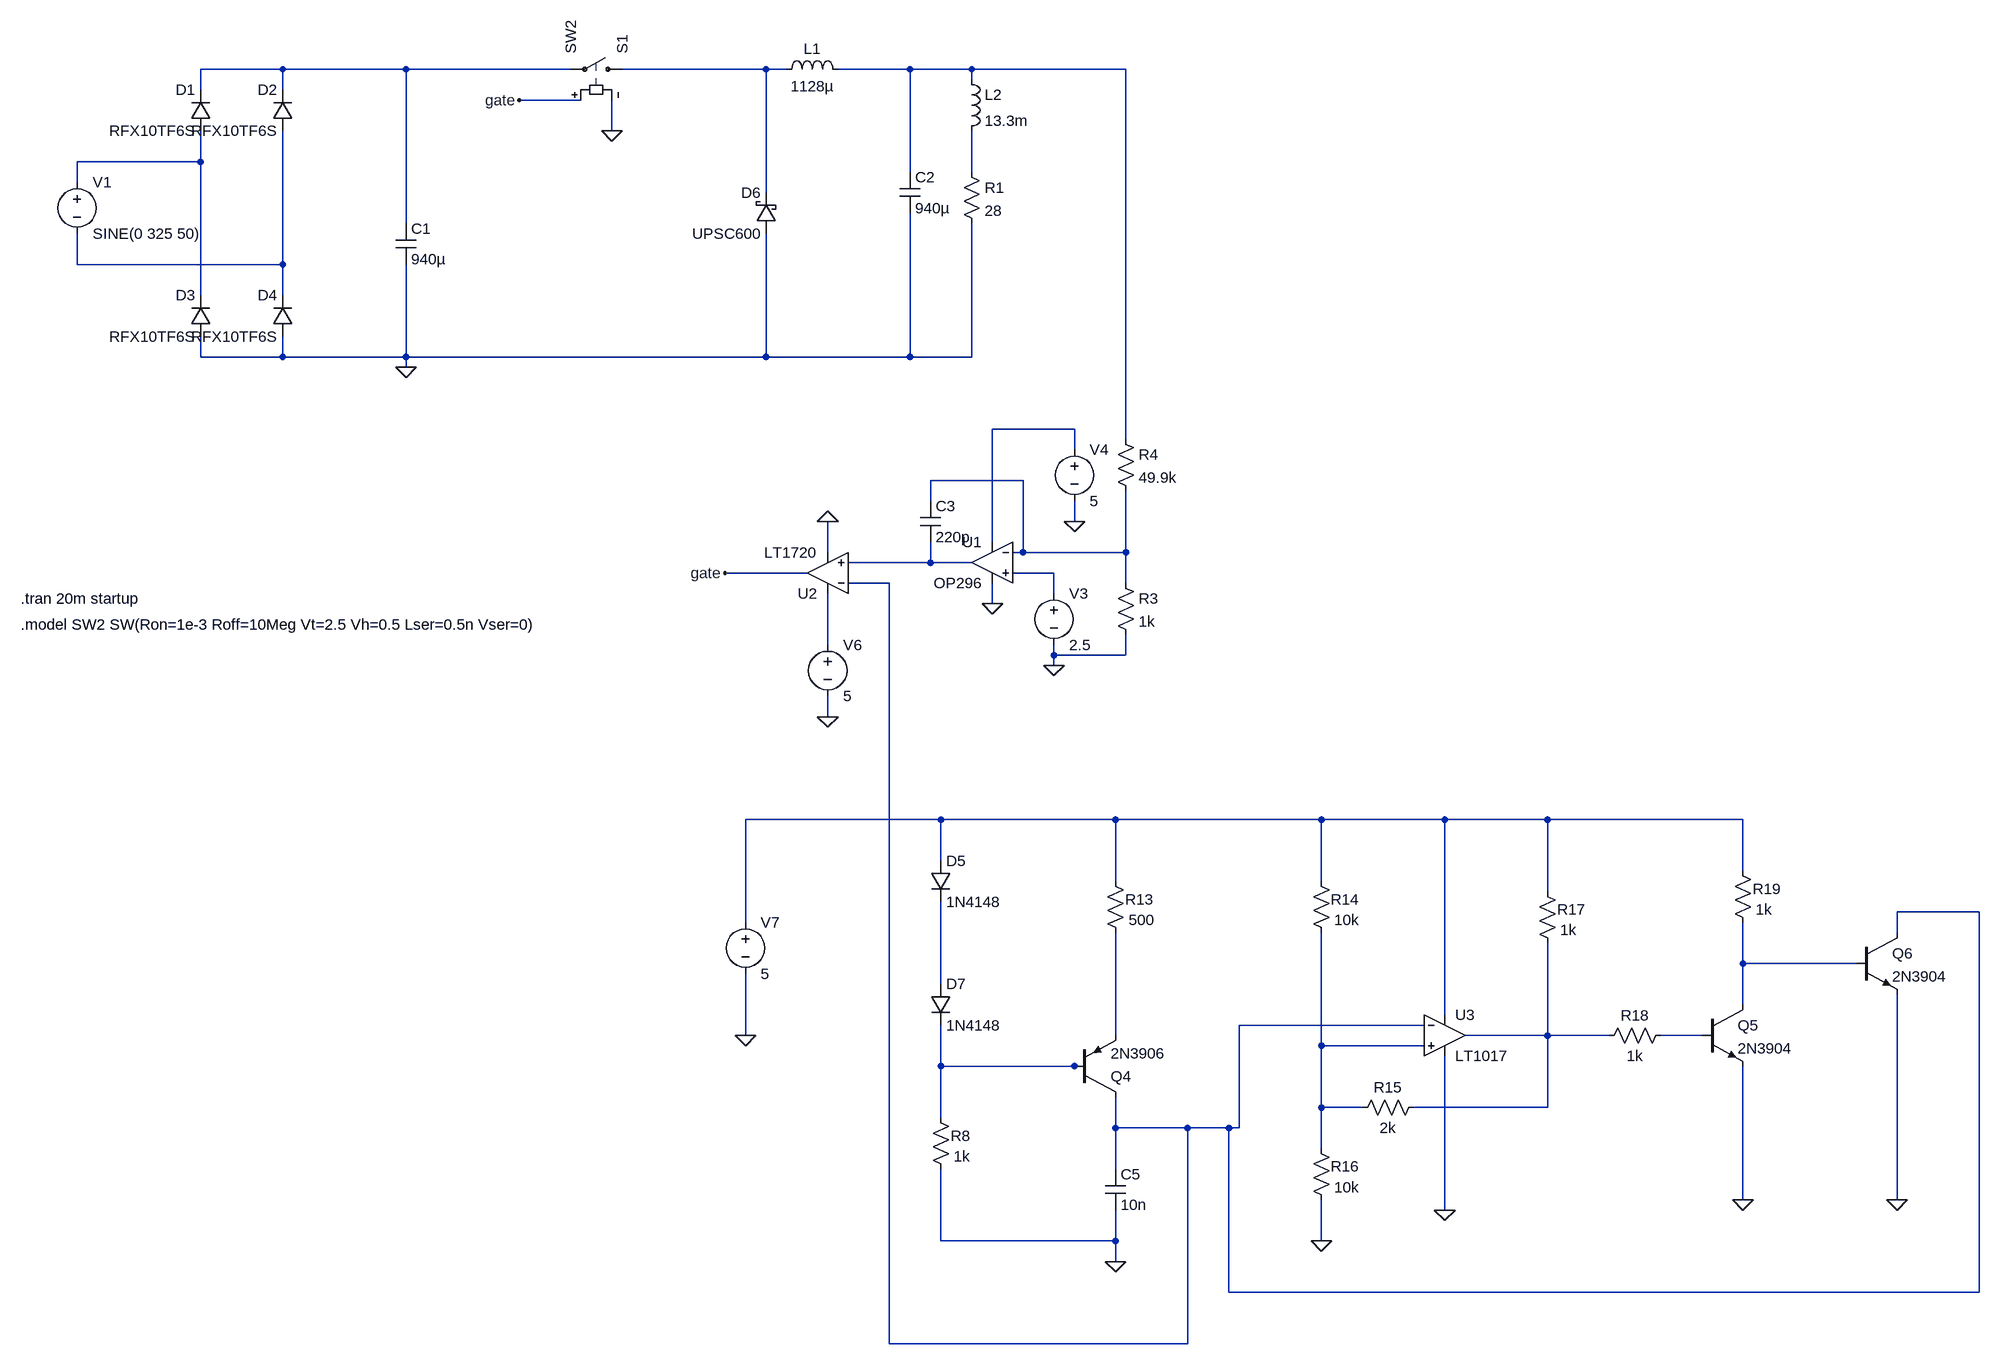
[diagram p0: schematic Simulation.asc]
Simulation.asc, the LTspice schematic file:
Version 4
SHEET 1 4248 2276
WIRE 240 -96 112 -96
WIRE 432 -96 240 -96
WIRE 688 -96 432 -96
WIRE 992 -96 768 -96
WIRE 1024 -96 992 -96
WIRE 1216 -96 1104 -96
WIRE 1312 -96 1216 -96
WIRE 1552 -96 1312 -96
WIRE 1312 -80 1312 -96
WIRE 112 -64 112 -96
WIRE 240 -64 240 -96
WIRE 704 -48 608 -48
WIRE 752 0 752 -48
WIRE 112 48 112 0
WIRE 112 48 -80 48
WIRE 1216 64 1216 -96
WIRE 1312 64 1312 0
WIRE -80 80 -80 48
WIRE 992 96 992 -96
WIRE 432 144 432 -96
WIRE -80 208 -80 160
WIRE 240 208 240 0
WIRE 240 208 -80 208
WIRE 112 256 112 48
WIRE 240 256 240 208
WIRE 112 352 112 320
WIRE 240 352 240 320
WIRE 240 352 112 352
WIRE 432 352 432 208
WIRE 432 352 240 352
WIRE 992 352 992 160
WIRE 992 352 432 352
WIRE 1216 352 1216 128
WIRE 1216 352 992 352
WIRE 1312 352 1312 144
WIRE 1312 352 1216 352
WIRE 432 368 432 352
WIRE 1472 464 1344 464
WIRE 1552 480 1552 -96
WIRE 1472 496 1472 464
WIRE 1392 544 1248 544
WIRE 1248 576 1248 544
WIRE 1472 608 1472 576
WIRE 1344 640 1344 464
WIRE 1088 656 1088 608
WIRE 1392 656 1392 544
WIRE 1392 656 1376 656
WIRE 1552 656 1552 560
WIRE 1552 656 1392 656
WIRE 1248 672 1248 640
WIRE 1248 672 1120 672
WIRE 1312 672 1248 672
WIRE 1056 688 928 688
WIRE 1440 688 1376 688
WIRE 1184 704 1120 704
WIRE 1552 704 1552 656
WIRE 1440 720 1440 688
WIRE 1344 736 1344 704
WIRE 1088 800 1088 720
WIRE 1440 816 1440 800
WIRE 1552 816 1552 784
WIRE 1552 816 1440 816
WIRE 1440 832 1440 816
WIRE 1088 912 1088 880
WIRE 1264 1072 960 1072
WIRE 1536 1072 1264 1072
WIRE 1856 1072 1536 1072
WIRE 2048 1072 1856 1072
WIRE 2208 1072 2048 1072
WIRE 2512 1072 2208 1072
WIRE 1264 1136 1264 1072
WIRE 2512 1152 2512 1072
WIRE 1536 1168 1536 1072
WIRE 1856 1168 1856 1072
WIRE 2208 1184 2208 1072
WIRE 2880 1216 2752 1216
WIRE 960 1232 960 1072
WIRE 2752 1248 2752 1216
WIRE 2512 1296 2512 1232
WIRE 2688 1296 2512 1296
WIRE 1264 1328 1264 1200
WIRE 2512 1360 2512 1296
WIRE 2048 1376 2048 1072
WIRE 2016 1392 1728 1392
WIRE 960 1408 960 1312
WIRE 1536 1408 1536 1248
WIRE 2208 1408 2208 1264
WIRE 2208 1408 2080 1408
WIRE 2304 1408 2208 1408
WIRE 2448 1408 2384 1408
WIRE 1856 1424 1856 1248
WIRE 2016 1424 1856 1424
WIRE 1264 1456 1264 1392
WIRE 1472 1456 1264 1456
WIRE 1488 1456 1472 1456
WIRE 1856 1520 1856 1424
WIRE 1920 1520 1856 1520
WIRE 2208 1520 2208 1408
WIRE 2208 1520 2000 1520
WIRE 1264 1536 1264 1456
WIRE 1536 1552 1536 1504
WIRE 1648 1552 1536 1552
WIRE 1712 1552 1648 1552
WIRE 1728 1552 1728 1392
WIRE 1728 1552 1712 1552
WIRE 1856 1584 1856 1520
WIRE 1536 1616 1536 1552
WIRE 2512 1664 2512 1456
WIRE 2752 1664 2752 1344
WIRE 2048 1680 2048 1440
WIRE 1264 1728 1264 1616
WIRE 1536 1728 1536 1680
WIRE 1536 1728 1264 1728
WIRE 1856 1728 1856 1664
WIRE 1536 1760 1536 1728
WIRE 1712 1808 1712 1552
WIRE 2880 1808 2880 1216
WIRE 2880 1808 1712 1808
WIRE 1184 1888 1184 704
WIRE 1648 1888 1648 1552
WIRE 1648 1888 1184 1888
FLAG 432 368 0
FLAG 1440 832 0
FLAG 1472 608 0
FLAG 1344 736 0
FLAG 1088 912 0
FLAG 752 0 0
FLAG 608 -48 gate
FLAG 928 688 gate
FLAG 1088 608 0
FLAG 960 1408 0
FLAG 1536 1760 0
FLAG 1856 1728 0
FLAG 2048 1680 0
FLAG 2512 1664 0
FLAG 2752 1664 0
SYMBOL res 1296 48 R0
SYMATTR InstName R1
SYMATTR Value 28
SYMBOL cap 416 144 R0
SYMATTR InstName C1
SYMATTR Value 940µ
SYMATTR SpiceLine Rser=0.1
SYMBOL voltage -80 64 R0
WINDOW 123 0 0 Left 2
WINDOW 39 0 0 Left 2
SYMATTR InstName V1
SYMATTR Value SINE(0 325 50)
SYMBOL ind 1008 -80 R270
WINDOW 0 32 56 VTop 2
WINDOW 3 5 56 VBottom 2
SYMATTR InstName L1
SYMATTR Value 1128µ
SYMATTR SpiceLine Rser=0.1
SYMBOL cap 1200 64 R0
SYMATTR InstName C2
SYMATTR Value 940µ
SYMATTR SpiceLine Rser=0.1
SYMBOL diode 128 0 R180
WINDOW 0 24 64 Left 2
WINDOW 3 24 0 Left 2
SYMATTR InstName D1
SYMATTR Value RFX10TF6S
SYMBOL diode 256 0 R180
WINDOW 0 24 64 Left 2
WINDOW 3 24 0 Left 2
SYMATTR InstName D2
SYMATTR Value RFX10TF6S
SYMBOL diode 128 320 R180
WINDOW 0 24 64 Left 2
WINDOW 3 24 0 Left 2
SYMATTR InstName D3
SYMATTR Value RFX10TF6S
SYMBOL diode 256 320 R180
WINDOW 0 24 64 Left 2
WINDOW 3 24 0 Left 2
SYMATTR InstName D4
SYMATTR Value RFX10TF6S
SYMBOL schottky 1008 160 R180
WINDOW 0 24 64 Left 2
WINDOW 3 24 0 Left 2
SYMATTR InstName D6
SYMATTR Value UPSC600
SYMATTR Description Diode
SYMATTR Type diode
SYMBOL Opamps\\OP296 1344 608 M0
SYMATTR InstName U1
SYMBOL voltage 1440 704 R0
WINDOW 123 0 0 Left 2
WINDOW 39 0 0 Left 2
SYMATTR InstName V3
SYMATTR Value 2.5
SYMBOL res 1536 688 R0
SYMATTR InstName R3
SYMATTR Value 1k
SYMBOL res 1536 464 R0
SYMATTR InstName R4
SYMATTR Value 49.9k
SYMBOL voltage 1472 480 R0
WINDOW 123 0 0 Left 2
WINDOW 39 0 0 Left 2
SYMATTR InstName V4
SYMATTR Value 5
SYMBOL Comparators\\LT1720 1088 752 R180
SYMATTR InstName U2
SYMBOL sw 784 -96 M270
SYMATTR InstName S1
SYMATTR Value SW2
SYMBOL cap 1232 576 R0
SYMATTR InstName C3
SYMATTR Value 220p
SYMBOL ind 1296 -96 R0
SYMATTR InstName L2
SYMATTR Value 13.3m
SYMBOL voltage 1088 784 R0
WINDOW 123 0 0 Left 2
WINDOW 39 0 0 Left 2
SYMATTR InstName V6
SYMATTR Value 5
SYMBOL res 1248 1520 R0
WINDOW 0 31 44 Left 2
SYMATTR InstName R8
SYMATTR Value 1k
SYMBOL voltage 960 1216 R0
WINDOW 123 0 0 Left 2
WINDOW 39 0 0 Left 2
SYMATTR InstName V7
SYMATTR Value 5
SYMBOL pnp 1472 1504 M180
SYMATTR InstName Q4
SYMATTR Value 2N3906
SYMBOL npn 2448 1360 R0
SYMATTR InstName Q5
SYMATTR Value 2N3904
SYMBOL npn 2688 1248 R0
SYMATTR InstName Q6
SYMATTR Value 2N3904
SYMBOL diode 1248 1136 R0
SYMATTR InstName D5
SYMATTR Value 1N4148
SYMBOL diode 1248 1328 R0
SYMATTR InstName D7
SYMATTR Value 1N4148
SYMBOL res 1520 1152 R0
WINDOW 0 31 44 Left 2
SYMATTR InstName R13
SYMATTR Value 500
SYMBOL res 1840 1152 R0
WINDOW 0 31 44 Left 2
SYMATTR InstName R14
SYMATTR Value 10k
SYMBOL cap 1520 1616 R0
SYMATTR InstName C5
SYMATTR Value 10n
SYMBOL res 2016 1504 R90
WINDOW 0 0 56 VBottom 2
WINDOW 3 32 56 VTop 2
SYMATTR InstName R15
SYMATTR Value 2k
SYMBOL res 1840 1568 R0
WINDOW 0 31 44 Left 2
SYMATTR InstName R16
SYMATTR Value 10k
SYMBOL res 2192 1168 R0
WINDOW 0 31 44 Left 2
SYMATTR InstName R17
SYMATTR Value 1k
SYMBOL res 2400 1392 R90
WINDOW 0 0 56 VBottom 2
WINDOW 3 32 56 VTop 2
SYMATTR InstName R18
SYMATTR Value 1k
SYMBOL res 2496 1136 R0
WINDOW 0 31 44 Left 2
SYMATTR InstName R19
SYMATTR Value 1k
SYMBOL Comparators\\LT1017 2048 1408 R0
SYMATTR InstName U3
TEXT -168 728 Left 2 !.tran 20m startup
TEXT -168 768 Left 2 !.model SW2 SW(Ron=1e-3 Roff=10Meg Vt=2.5 Vh=0.5 Lser=0.5n Vser=0)

The netlist it stands for:
* Simulation.asc
R1 N005 0 28
C1 N001 0 940µ Rser=0.1
V1 N004 N006 SINE(0 325 50)
L1 N002 N003 1128µ Rser=0.1
C2 N003 0 940µ Rser=0.1
D1 N004 N001 RFX10TF6S
D2 N006 N001 RFX10TF6S
D3 0 N004 RFX10TF6S
D4 0 N006 RFX10TF6S
D6 0 N002 UPSC600
XU1 N010 N008 N007 0 N009 OP296  ; pins In+ In- V+ V- OUT
V3 N010 0 2.5
R3 N008 0 1k
R4 N003 N008 49.9k
V4 N007 0 5
XU2 N009 N011 N012 0 gate LT1720  ; pins In+ In- V+ V- OUT
S1 N002 N001 gate 0 SW2
C3 N008 N009 220p
L2 N003 N005 13.3m
V6 N012 0 5
R8 N020 0 1k
V7 N013 0 5
Q4 N011 N020 N016 0 2N3906
Q5 N014 N018 0 0 2N3904
Q6 N011 N014 0 0 2N3904
D5 N013 N015 1N4148
D7 N015 N020 1N4148
R13 N013 N016 500
R14 N013 N019 10k
C5 N011 0 10n
R15 N017 N019 2k
R16 N019 0 10k
R17 N013 N017 1k
R18 N018 N017 1k
R19 N013 N014 1k
XU3 N019 N011 N013 0 N017 LT1017  ; pins In+ In- V+ V- OUT
.model D D
.lib standard.dio
.model NPN NPN
.model PNP PNP
.lib standard.bjt
.tran 20m startup
.model SW2 SW(Ron=1e-3 Roff=10Meg Vt=2.5 Vh=0.5 Lser=0.5n Vser=0)
.lib LT1720.sub
.backanno
.end